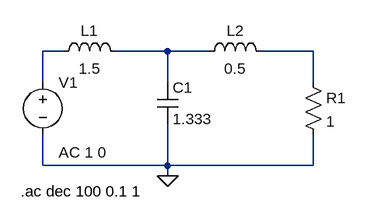
[diagram p0: schematic 2.asc]
2.asc, the LTspice schematic file:
Version 4
SHEET 1 880 680
WIRE 128 144 96 144
WIRE 288 144 208 144
WIRE 352 144 288 144
WIRE 512 144 432 144
WIRE 96 192 96 144
WIRE 288 192 288 144
WIRE 512 192 512 144
WIRE 96 320 96 272
WIRE 288 320 288 256
WIRE 288 320 96 320
WIRE 512 320 512 272
WIRE 512 320 288 320
WIRE 288 336 288 320
FLAG 288 336 0
SYMBOL ind 112 160 R270
WINDOW 0 32 56 VTop 2
WINDOW 3 5 56 VBottom 2
SYMATTR InstName L1
SYMATTR Value 1.5
SYMBOL ind 336 160 R270
WINDOW 0 32 56 VTop 2
WINDOW 3 5 56 VBottom 2
SYMATTR InstName L2
SYMATTR Value 0.5
SYMBOL cap 272 192 R0
SYMATTR InstName C1
SYMATTR Value 1.333
SYMBOL res 496 176 R0
SYMATTR InstName R1
SYMATTR Value 1
SYMBOL voltage 96 176 R0
WINDOW 123 24 124 Left 2
WINDOW 39 0 0 Left 0
SYMATTR InstName V1
SYMATTR Value ""
SYMATTR Value2 AC 1 0
TEXT 62 360 Left 2 !.ac dec 100 0.1 1

The netlist it stands for:
* 2.asc
L1 N001 N002 1.5
L2 N002 N003 0.5
C1 N002 0 1.333
R1 N003 0 1
V1 N001 0 AC 1 0
.ac dec 100 0.1 1
.backanno
.end